# Altium schematic sheet Sensor_Board.SchDoc
size A3; Engineer: Emirhan BOZKURT; SheetNumber: 5; SheetTotal: 5; PageSize: A3; Position: R&D Electronics Engineer
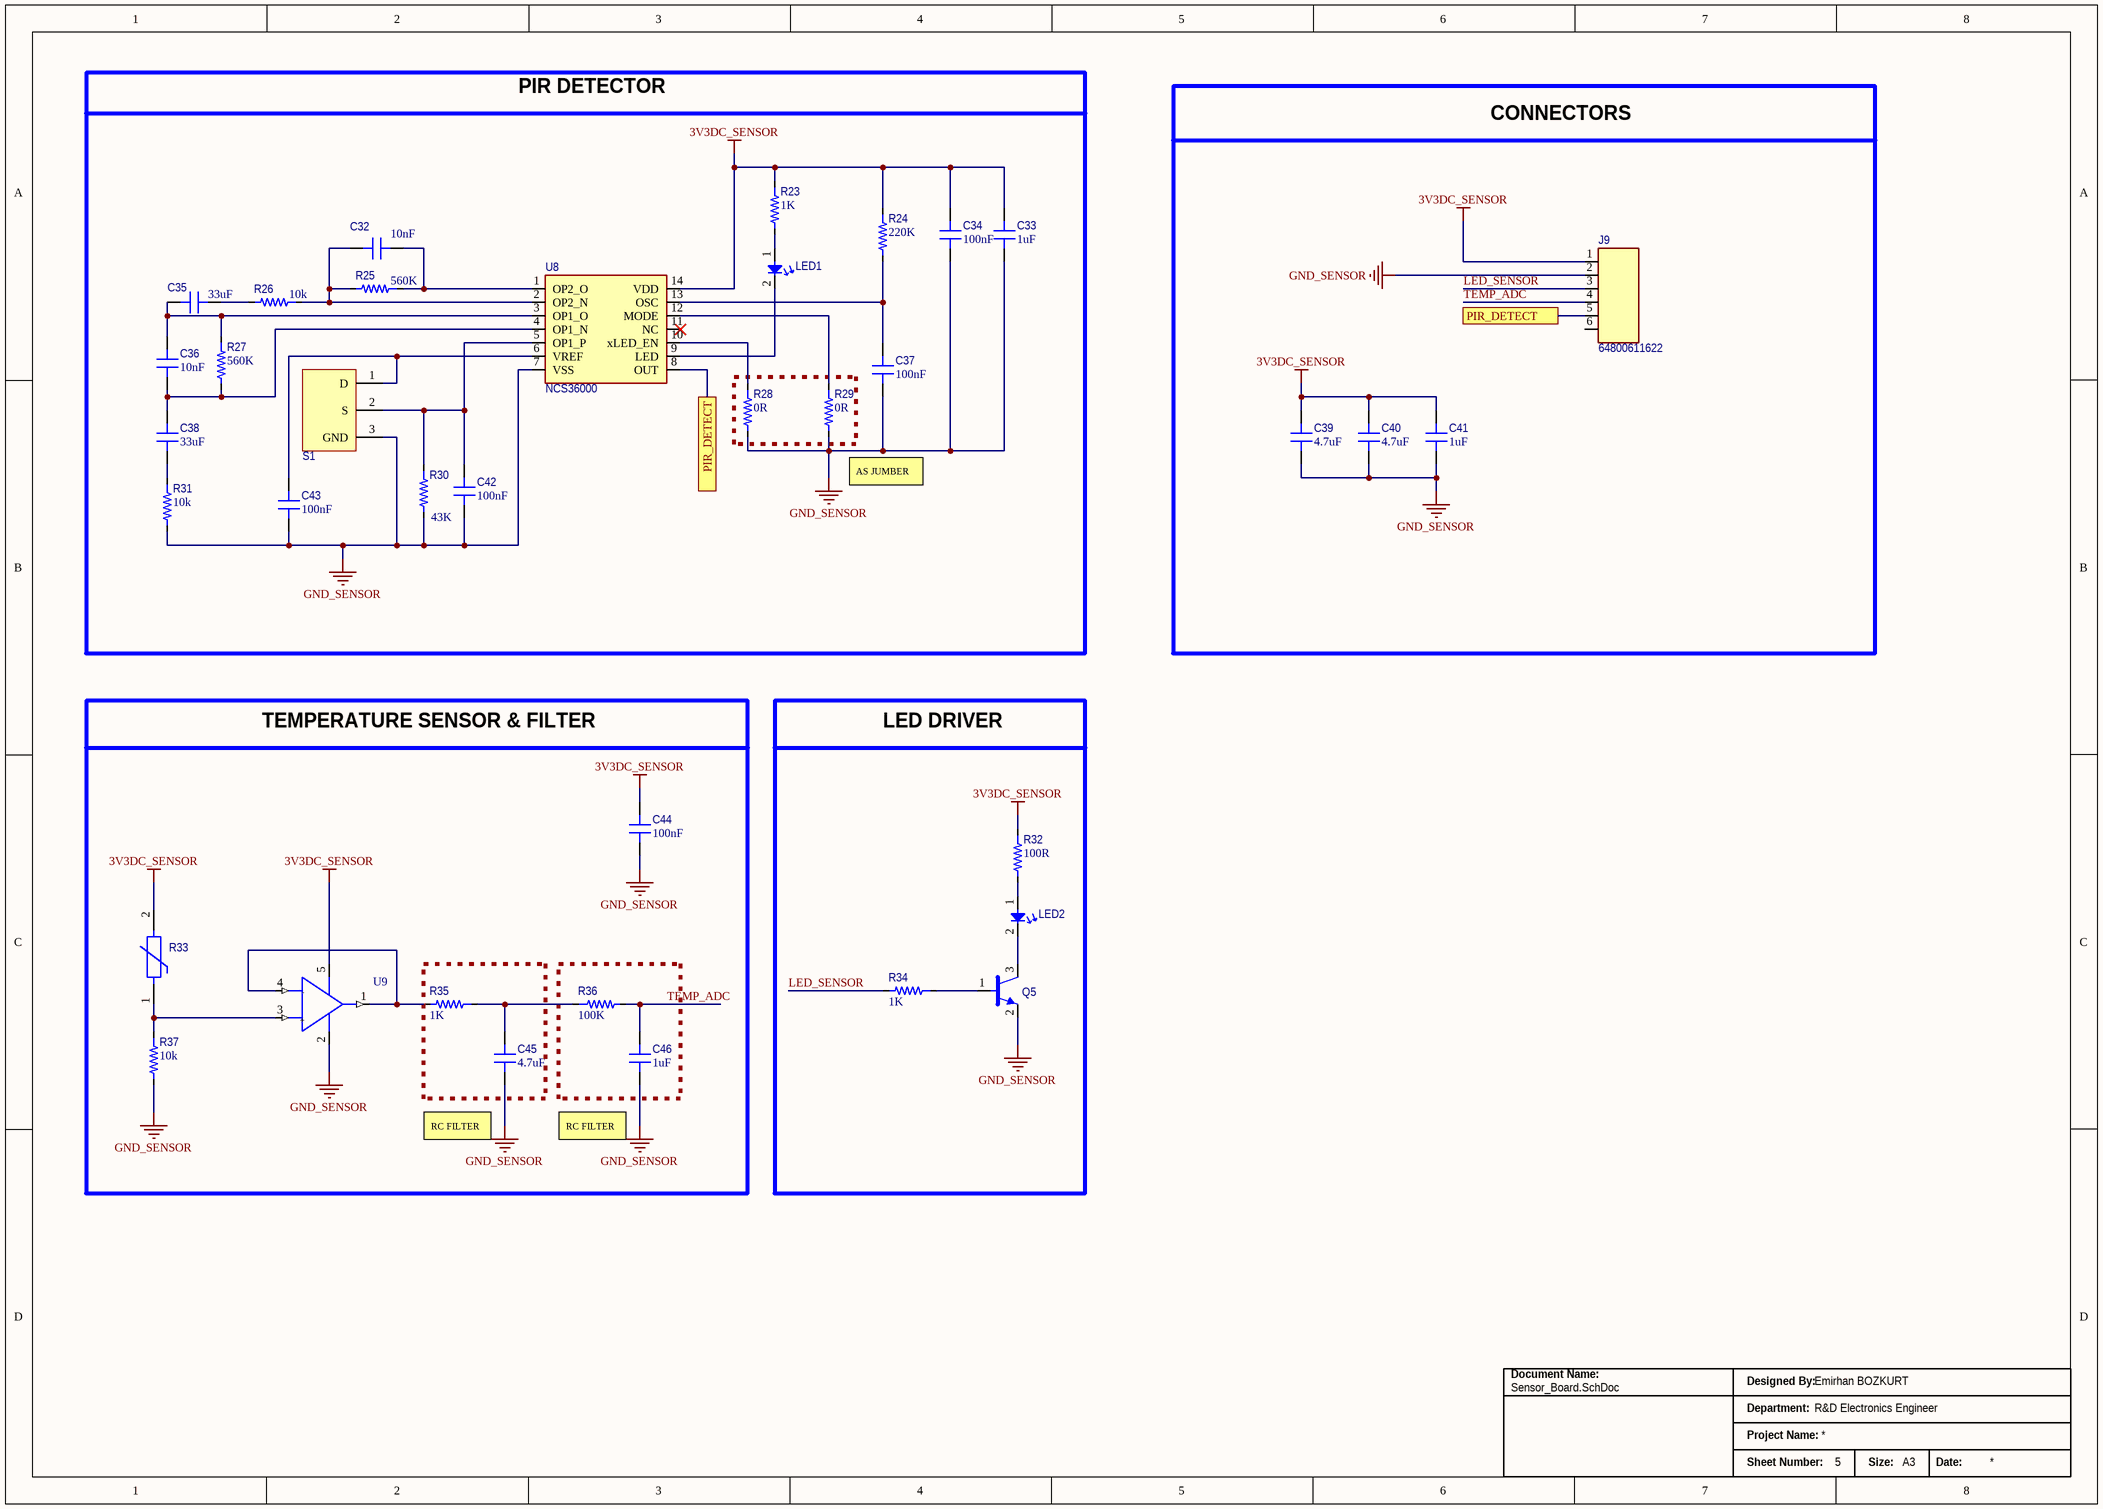
[diagram p0: Sensor_Board.SchDoc]

## Parts
C32  value 10nF  [CAP_0603]  (hidden comment: CL10B102KB8NNNC)
C33  value 1uF  [CAP_0805]  (hidden comment: CL21B105KBFNNNE)
C34  value 100nF  [CAP_0805]  (hidden comment: 1276-1003-2-ND)
C35  value 33uF  [CAP_0603]  (hidden comment: C3216X7S0J336M160AC)
C36  value 10nF  [CAP_0603]  (hidden comment: CL10B102KB8NNNC)
C37  value 100nF  [CAP_0805]  (hidden comment: 1276-1003-2-ND)
C38  value 33uF  [CAP_0603]  (hidden comment: C3216X7S0J336M160AC)
C39  value 4.7uF  [CAP_0805]  (hidden comment: CL21A475KAQNNNE)
C40  value 4.7uF  [CAP_0805]  (hidden comment: CL21A475KAQNNNE)
C41  value 1uF  [CAP_0805]  (hidden comment: CL21B105KBFNNNE)
C42  value 100nF  [CAP_0805]  (hidden comment: 1276-1003-2-ND)
C43  value 100nF  [CAP_0805]  (hidden comment: 1276-1003-2-ND)
C44  value 100nF  [CAP_0805]  (hidden comment: 1276-1003-2-ND)
C45  value 4.7uF  [CAP_0805]  (hidden comment: CL21A475KAQNNNE)
C46  value 1uF  [CAP_0805]  (hidden comment: CL21B105KBFNNNE)
J9  64800611622  [64800611622]
LED1  LTST-C171GKT  [LED GREEN 0805]  (value not drawn)
LED2  LTST-C171KRKT  [LED RED 0805]  (value not drawn)
Q5  MMBT3904-7-F  [SOT-23F]  (value not drawn)
R23  value 1K  [RES_0603]  (hidden comment: RC0603FR-071KL)
R24  value 220K  [RES_0603]  (hidden comment: RC0603FR-07220KL)
R25  value 560K  [RES_0603]  (hidden comment: RC0603FR-07560KL)
R26  value 10k  [RES_0603]  (hidden comment: RC0603FR-0710KL)
R27  value 560K  [RES_0603]  (hidden comment: RC0603FR-07560KL)
R28  value 0R  [RES_0603]  (hidden comment: CR160000F)
R29  value 0R  [RES_0603]  (hidden comment: CR160000F)
R30  value 43K  [RES_0603]  (hidden comment: RC0603FR-0743KL)
R31  value 10k  [RES_0603]  (hidden comment: RC0603FR-0710KL)
R32  value 100R  [RES_0603]  (hidden comment: RC0603FR-07100RL)
R33  TFPT1206L1002FM  [PTC_1206]  (value not drawn)
R34  value 1K  [RES_0603]  (hidden comment: RC0603FR-071KL)
R35  value 1K  [RES_0603]  (hidden comment: RC0603FR-071KL)
R36  value 100K  [RES_0603]  (hidden comment: RC0603FR-07100KL)
R37  value 10k  [RES_0603]  (hidden comment: RC0603FR-0710KL)
S1  LHI 878/3902  [LHI 878]  (value not drawn)
U8  NCS36000  [NCS36000]
U9  OPA314AIDBVR  [OPA314]  (value not drawn)

## Blocks framed on the sheet
PIR DETECTOR: C32-C38 C42 C43 LED1 R23-R31 S1 U8
CONNECTORS: C39-C41 J9
TEMPERATURE SENSOR & FILTER: C44-C46 R33 R35-R37 U9
LED DRIVER: LED2 Q5 R32 R34

## Ports
PIR_DETECT

## Nets
3V3DC_SENSOR: C33.2 C34.2 C39.2 C40.2 C41.2 C44.2 J9.1 R23.2 R24.2 R32.2 R33.2 U8.14(VDD) U9.5(V-)
GND_SENSOR: C33.1 C34.1 C37.1 C39.1 C40.1 C41.1 C42.1 C43.1 C44.1 C45.1 C46.1 J9.2 Q5.2(E) R28.1 R29.1 R30.1 R31.1 R37.1 S1.3(GND) U8.7(VSS) U9.2(V+)
LED_SENSOR: J9.3 R34.1
PIR_DETECT: J9.5 U8.8(OUT) ; port PIR_DETECT
TEMP_ADC: C46.2 J9.4 R36.1
NetC32_1: C32.1 R25.1 R26.2 U8.2(OP2_N)
NetC32_2: C32.2 R25.2 U8.1(OP2_O)
NetC35_1: C35.1 C36.2 R27.2 U8.3(OP1_O)
NetC35_2: C35.2 R26.1
NetC36_1: C36.1 C38.2 R27.1 U8.4(OP1_N)
NetC37_2: C37.2 R24.1 U8.13(OSC)
NetC38_1: C38.1 R31.2
NetC42_2: C42.2 R30.2 S1.2(S) U8.5(OP1_P)
NetC43_2: C43.2 S1.1(D) U8.6(VREF)
NetC45_2: C45.2 R35.2 R36.2
NetLED1_1: LED1.1 R23.1
NetLED1_2: LED1.2 U8.9(LED)
NetLED2_1: LED2.1 R32.1
NetLED2_2: LED2.2 Q5.3(C)
NetQ5_1: Q5.1(B) R34.2
NetR28_2: R28.2 U8.10(xLED_EN)
NetR29_2: R29.2 U8.12(MODE)
NetR33_1: R33.1 R37.2 U9.3(+IN)
NetR35_1: R35.1 U9.1(OUT) U9.4(-IN)

Not connected (* = marked no-connect by the designer): J9 6; U8 11(NC)*

## Notes on the sheet
- (near R29) AS JUMBER
- (near C45) RC FILTER
- RC FILTER
- Document Name:
- Designed By:
- Department:
- Project Name:
- Sheet Number:
- Size:
- Date:
- (in symbol OPA314AIDBVR) -; +

## Library data of the parts
C32 C36 = CAP CER 10nF 0603: CAP CER 1000pF 50V X7R 0603; Manufacturer: Samsung Electro-Mechanics; Designed By: Emirhan Bozkurt; Supplier Part Number: 1276-1018-1-ND; Supplier 1: DigiKey; Case Package: 0603; Mounting Type: Surface Mount; Manufacturer Product Number: CL10B102KB8NNNC
C33 C41 C46 = CAP CER 1uF 0805: CAP CER 1uF 25V X5R 0805; Manufacturer: Samsung Electro-Mechanics; Designed By: Emirhan Bozkurt; Supplier Part Number: 1276-1029-1-ND; Supplier 1: DigiKey; Case Package: 0805; Mounting Type: Surface Mount; Manufacturer Product Number: CL21B105KBFNNNE
C34 C37 C42-C44 = CAP CER 100nF 0805: CAP CER 0.1uF 50V X7R 0805; Designed By: Emirhan Bozkurt; Supplier Part Number: 1276-1003-2-ND; Supplier 1: DigiKey; Case Package: 0805; Mounting Type: Surface Mount; Manufacturer Product Number: 1276-1003-2-ND
C35 C38 = CAP CER 33uF 1206: CAP CER 33UF 6.3V X7S 1206; Manufacturer: TDK Corporation; Designed By: Emirhan Bozkurt; Supplier Part Number: 445-14814-2-ND; Supplier 1: DigiKey; Case Package: 1206; Mounting Type: Surface Mount; Manufacturer Product Number: C3216X7S0J336M160AC
C39 C40 C45 = CAP CER 4.7uF 0805: CAP CER 4.7uF 25V X5R 0805; Manufacturer: Samsung Electro-Mechanics; Designed By: Emirhan Bozkurt; Supplier Part Number: CL21A475KAQNNNE; Supplier 1: DigiKey; Case Package: 0805; Mounting Type: Surface Mount; Manufacturer Product Number: CL21A475KAQNNNE
J9 = 64800611622-CONN-6P: WR-WTB WIRE-TO-BOARD CONNECTORS; Manufacturer: WE; Manufacturer Product Number: 1SMB5919BT3G; Pitch: 1.5 mm; Number of Positions: 6; Designed By: Emirhan Bozkurt; Supplier Part Number: 732-64800611622-ND; Supplier 1: DigiKey; Contact Type: Male
LED1 = LED GREEN: LED GREEN CLEAR SMD; Manufacturer: Lite-On Inc.; Designed By: Emirhan Bozkurt; Supplier Part Number: 160-1423-2-ND; Supplier 1: DigiKey; Color: Green; Manufacturer Product Number: LTST-C171GKT
LED2 = LED RED: LED RED CLEAR SMD; Manufacturer: Lite-On Inc.; Manufacturer Product Number: LTST-C171KRKsT; Designed By: Emirhan Bozkurt; Supplier Part Number: 160-1427-2-ND; Supplier 1: DigiKey; Color: Red
Q5 = MMBT3904-7-F: TRANS NPN 40V 0.2A SOT-23-3; Parameter 1: Surface Mount; Supplier Part Number: MMBT3904-FDICT-ND; Supplier 1: DigiKey; ComponentLink1Description: Datasheet; ComponentLink1URL: https://www.digikey.com/en/products/detail/toshiba-semiconductor-and-storage/SSM3K357R-LF/8611159; FET Type: NPN; Voltage - Collector Emitter: 40V; Case Package: SOT-23-3; Manufacturer Product Number: MMBT3904-7-F
R23 R34 R35 = RES 1K 0603: RES 1K 1% 1/10W 0603; Suppier Part Number: 311-1.00KHRCT-ND; Manufacturer: YAGEO; Designed By: Emirhan Bozkurt; Supplier 1: DigiKey; Case Package: 0603; Mounting Type: Surface Mount; Category: Chip Resistor; Manufacturer Product Number: RC0603FR-071KL
R24 = RES 220K 0603: RES 220K OHM 1% 1/10W 0603; Suppier Part Number: 311-220KHRTR-ND; Manufacturer: YAGEO; Designed By: Emirhan Bozkurt; Supplier 1: DigiKey; Case Package: 0603; Mounting Type: Surface Mount; Category: Chip Resistor; Manufacturer Product Number: RC0603FR-07220KL
R25 R27 = RES 560K 0603: RES 1560K 1% 1/10W 0603; Suppier Part Number: 311-560KHRCT-ND; Manufacturer: YAGEO; Designed By: Emirhan Bozkurt; Supplier 1: DigiKey; Case Package: 0603; Mounting Type: Surface Mount; Category: Chip Resistor; Manufacturer Product Number: RC0603FR-07560KL
R26 R31 R37 = RES 10K 0603: RES 10K OHM 1% 1/10W 0603; Suppier Part Number: 311-10.0KHRTR-ND; Manufacturer: YAGEO; Designed By: Emirhan Bozkurt; Supplier 1: DigiKey; Case Package: 0603; Mounting Type: Surface Mount; Category: Chip Resistor; Manufacturer Product Number: RC0603FR-0710KL
R28 R29 = RES 0R 0603: RES 0 OHM 1% 1/10W 0603; Suppier Part Number: 2997-CR160000FTR-ND; Manufacturer: YAGEO; Designed By: Emirhan Bozkurt; Supplier 1: DigiKey; Case Package: 0603; Mounting Type: Surface Mount; Category: Chip Resistor; Manufacturer Product Number: CR160000F
R30 = RES 43K 0603: RES 43K OHM 1% 1/10W 0603; Suppier Part Number: 311-43.0KHRTR-ND; Manufacturer: YAGEO; Designed By: Emirhan Bozkurt; Supplier 1: DigiKey; Case Package: 0603; Mounting Type: Surface Mount; Category: Chip Resistor; Manufacturer Product Number: RC0603FR-0743KL
R32 = RES 100R 0603: RES 100 OHM 1% 1/10W 0603; Suppier Part Number: 311-100HRTR-ND; Manufacturer: YAGEO; Designed By: Emirhan Bozkurt; Supplier 1: DigiKey; Case Package: 0603; Mounting Type: Surface Mount; Category: Chip Resistor; Manufacturer Product Number: RC0603FR-07100RL
R33 = TFPT1206L1002FM: SENSOR PTC 10KOHM 1% 1206; Designed By: Emirhan Bozkurt; Value: 10k; Supplier Part Number: 541-3533-2-ND; Supplier 1: DigiKey; Case Package: 1206; Min Operating Temperature: -55; Max Operating Temperature: +70; Manufacturer Product Number: TFPT1206L1002FM
R36 = RES 100K 0603: RES 100K OHM 1% 1/10W 0603; Suppier Part Number: 311-100KHRCT-ND; Manufacturer: YAGEO; Designed By: Emirhan Bozkurt; Supplier 1: DigiKey; Case Package: 0603; Mounting Type: Surface Mount; Category: Chip Resistor; Manufacturer Product Number: RC0603FR-07100KL
S1 = LHI 878/3902: SENSOR PYRO DETECTOR DUAL MOTION; Designed By: Emirhan Bozkurt; Max Supply Voltage: 12V; Min Supply Voltage: 2V; Supplier Part Number: 1601-LHI878/3902-ND; Supplier 1: DigiKey; Mounting Type: TH; Manufacturer Product Number: LHI 878/3902
U8 = NCS36000: IC PIR DETECTOR CTLR 14SOIC; Manufacturer: Onsemi; Manufacturer Product Number: NCS36000DRG; Designed By: Emirhan Bozkurt; Supplier Part Number: NCS36000DRGOSCT-ND; Supplier 1: DigiKey; ComponentLink1Description: Datasheet; ComponentLink1URL: https://www.onsemi.com/pdf/datasheet/ncs36000-d.pdf; Case Package: SOIC-14
U9 = OPA314AIDBVR: IC OPAMP GP 1 CIRCUIT SOT23-5; Manufacturer: Texas Instruments; Designed By: Emirhan Bozkurt; Supplier Part Number: 296-36699-1-ND; Supplier 1: DigiKey; Case Package: SOT-23-5 Texas Instruments; Mounting Type: Surface Mount; Manufacturer Product Number: OPA314AIDBVR